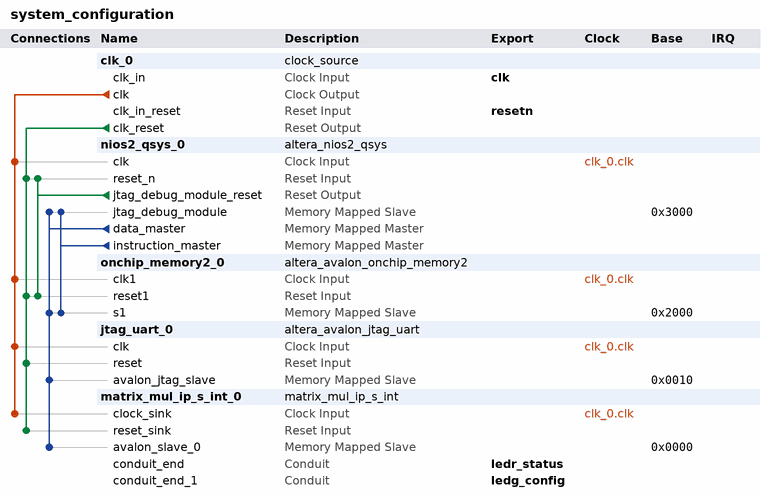
[diagram p0: system contents]
# Platform Designer (Qsys) system system_configuration, Cyclone II EP2C20F484C7
# Parameters at their usual value, and those the tool derives, are not listed.
package require -exact qsys 13.0
create_system system_configuration
set_project_property DEVICE_FAMILY {Cyclone II}
set_project_property DEVICE EP2C20F484C7

add_instance clk_0 clock_source 13.0
set_instance_parameter_value clk_0 clockFrequency 50000000

add_instance nios2_qsys_0 altera_nios2_qsys 13.0
set_instance_parameter_value nios2_qsys_0 resetSlave onchip_memory2_0.s1
set_instance_parameter_value nios2_qsys_0 mmu_TLBMissExcSlave None
set_instance_parameter_value nios2_qsys_0 exceptionSlave onchip_memory2_0.s1
set_instance_parameter_value nios2_qsys_0 breakSlave nios2_qsys_0.jtag_debug_module
set_instance_parameter_value nios2_qsys_0 impl Tiny
set_instance_parameter_value nios2_qsys_0 icache_size 4096

add_instance onchip_memory2_0 altera_avalon_onchip_memory2 13.0.1.99.2
set_instance_parameter_value onchip_memory2_0 dataWidth 32
set_instance_parameter_value onchip_memory2_0 dualPort false
set_instance_parameter_value onchip_memory2_0 initMemContent true
set_instance_parameter_value onchip_memory2_0 initializationFileName onchip_mem.hex
set_instance_parameter_value onchip_memory2_0 memorySize 4096

add_instance jtag_uart_0 altera_avalon_jtag_uart 13.0.1.99.2
set_instance_parameter_value jtag_uart_0 allowMultipleConnections true
set_instance_parameter_value jtag_uart_0 readBufferDepth 256
set_instance_parameter_value jtag_uart_0 simInteractiveOptions NO_INTERACTIVE_WINDOWS
set_instance_parameter_value jtag_uart_0 writeBufferDepth 256

add_instance matrix_mul_ip_s_int_0 matrix_mul_ip_s_int 1.0
set_instance_parameter_value matrix_mul_ip_s_int_0 AVALON_DATA_WIDTH 32
set_instance_parameter_value matrix_mul_ip_s_int_0 NUM_OF_8_BIT_REGISTERS 16
set_instance_parameter_value matrix_mul_ip_s_int_0 WRITE_DATA_CAPTURE_CYCLE 1
set_instance_parameter_value matrix_mul_ip_s_int_0 COLUMN_TOTAL 10
set_instance_parameter_value matrix_mul_ip_s_int_0 OPCODE_WIDTH 3
set_instance_parameter_value matrix_mul_ip_s_int_0 ADDR_WIDTH 5
set_instance_parameter_value matrix_mul_ip_s_int_0 DATA_WIDTH 18
set_instance_parameter_value matrix_mul_ip_s_int_0 DATA_WIDE_WIDTH 48

# connections
add_connection clk_0.clk jtag_uart_0.clk clock
add_connection clk_0.clk matrix_mul_ip_s_int_0.clock_sink clock
add_connection clk_0.clk nios2_qsys_0.clk clock
add_connection clk_0.clk onchip_memory2_0.clk1 clock
add_connection clk_0.clk_reset jtag_uart_0.reset reset
add_connection clk_0.clk_reset matrix_mul_ip_s_int_0.reset_sink reset
add_connection clk_0.clk_reset nios2_qsys_0.reset_n reset
add_connection clk_0.clk_reset onchip_memory2_0.reset1 reset
add_connection nios2_qsys_0.jtag_debug_module_reset nios2_qsys_0.reset_n reset
add_connection nios2_qsys_0.jtag_debug_module_reset onchip_memory2_0.reset1 reset
add_connection nios2_qsys_0.data_master jtag_uart_0.avalon_jtag_slave avalon
set_connection_parameter_value nios2_qsys_0.data_master/jtag_uart_0.avalon_jtag_slave baseAddress 0x0010
add_connection nios2_qsys_0.data_master matrix_mul_ip_s_int_0.avalon_slave_0 avalon
set_connection_parameter_value nios2_qsys_0.data_master/matrix_mul_ip_s_int_0.avalon_slave_0 baseAddress 0x0000
add_connection nios2_qsys_0.data_master nios2_qsys_0.jtag_debug_module avalon
set_connection_parameter_value nios2_qsys_0.data_master/nios2_qsys_0.jtag_debug_module baseAddress 0x3000
add_connection nios2_qsys_0.data_master onchip_memory2_0.s1 avalon
set_connection_parameter_value nios2_qsys_0.data_master/onchip_memory2_0.s1 baseAddress 0x2000
add_connection nios2_qsys_0.instruction_master nios2_qsys_0.jtag_debug_module avalon
set_connection_parameter_value nios2_qsys_0.instruction_master/nios2_qsys_0.jtag_debug_module baseAddress 0x3000
add_connection nios2_qsys_0.instruction_master onchip_memory2_0.s1 avalon
set_connection_parameter_value nios2_qsys_0.instruction_master/onchip_memory2_0.s1 baseAddress 0x2000

# exported interfaces
add_interface clk clock sink
set_interface_property clk EXPORT_OF clk_0.clk_in
add_interface resetn reset sink
set_interface_property resetn EXPORT_OF clk_0.clk_in_reset
add_interface ledr_status conduit end
set_interface_property ledr_status EXPORT_OF matrix_mul_ip_s_int_0.conduit_end
add_interface ledg_config conduit end
set_interface_property ledg_config EXPORT_OF matrix_mul_ip_s_int_0.conduit_end_1

set_interconnect_requirement {$system} qsys_mm.clockCrossingAdapter HANDSHAKE
set_interconnect_requirement {$system} qsys_mm.maxAdditionalLatency 1

save_system system_configuration.qsys
